# EAGLE design usb-audio (EAGLE 8.7.0)
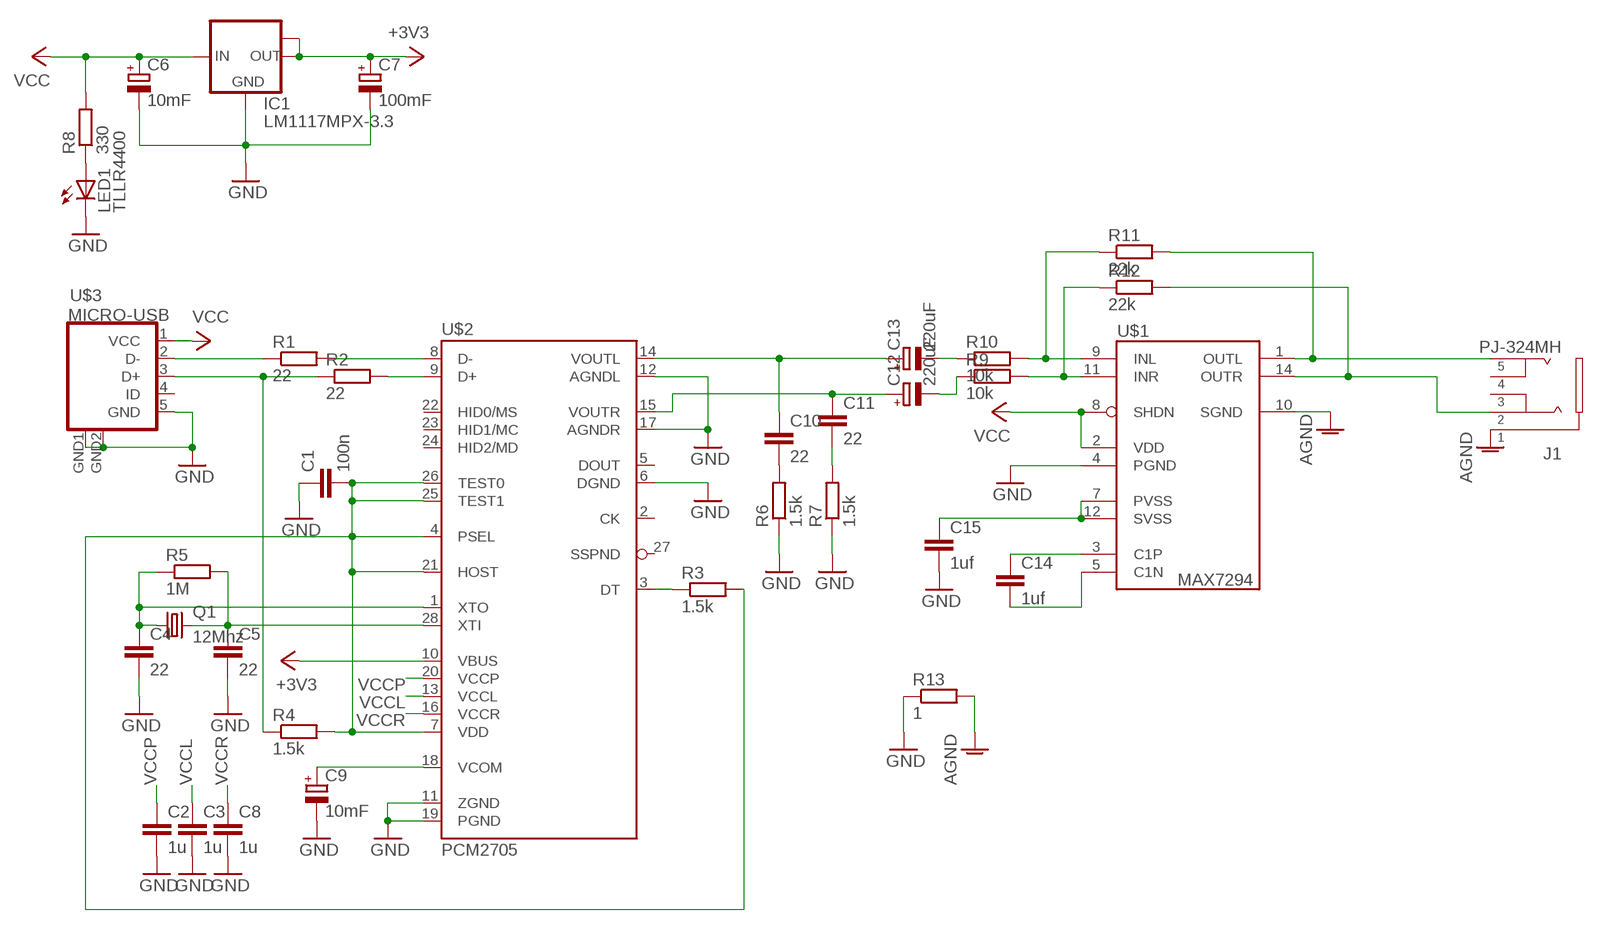
[diagram p0: schematic, sheet 1]

## Parts
C1  100n  C-EUC0805  [C0805]
C2  1u  C-EUC0805  [C0805]
C3  1u  C-EUC0805  [C0805]
C4  22  C-EUC0805  [C0805]
C5  22  C-EUC0805  [C0805]
C6  10mF  CPOL-EUCT3216  [CT3216]
C7  100mF  CPOL-EUCT3216  [CT3216]
C8  1u  C-EUC0805  [C0805]
C9  10mF  CPOL-EUCT3216  [CT3216]
C10  22  C-EUC0805  [C0805]
C11  22  C-EUC0805  [C0805]
C12  220uF  CPOL-EUE2-5  [E2-5]
C13  220uF  CPOL-EUE2-5  [E2-5]
C14  1uf  C-EUC0805  [C0805]
C15  1uf  C-EUC0805  [C0805]
IC1  LM1117MPX-3.3  [SOT223]
J1  PJ-324MH  [PJ-324MH]
LED1  TLLR4400  [LED3MM]
Q1  12Mhz  CRYSTALHC49S  [HC49/S]
R1  22  R-EU_R0805  [R0805]
R2  22  R-EU_R0805  [R0805]
R3  1.5k  R-EU_R0805  [R0805]
R4  1.5k  R-EU_R0805  [R0805]
R5  1M  R-EU_R0805  [R0805]
R6  1.5k  R-EU_R0805  [R0805]
R7  1.5k  R-EU_R0805  [R0805]
R8  330  R-EU_R0805  [R0805]
R9  10k  R-EU_R0805  [R0805]
R10  10k  R-EU_R0805  [R0805]
R11  22k  R-EU_R0805  [R0805]
R12  22k  R-EU_R0805  [R0805]
R13  1  R-EU_R0805  [R0805]
U$1  MAX9724AEUD+  [TSSOP14]
U$2  PCM2705  [SSOP28]
U$3  MICRO-USB  [MICRO-USB]

## Nets
+3V3 [VCC]: C7.+ IC1.2(OUT) IC1.TAB(OUT1) U$2.10(VBUS)
AGND [AGND]: J1.1 R13.2 U$1.10(SGND)
GND [GND]: C1.1 C2.2 C3.2 C4.2 C5.2 C6.- C7.- C8.2 C9.- C15.2 IC1.1(GND) LED1.K(C) R6.1 R7.1 R13.1 U$1.4(PGND) U$2.6(DGND) U$2.11(ZGND) U$2.12(AGNDL) U$2.17(AGNDR) U$2.19(PGND) U$3.5(GND) U$3.GND1(GND) U$3.GND2(GND)
N$1: R1.2 U$2.8(D-)
N$2: R2.2 U$2.9(D+)
N$3: C9.+ U$2.18(VCOM)
N$4: R3.1 U$2.3(DT)
N$5: R1.1 U$3.2(D-)
N$6: R2.1 R4.1 U$3.3(D+)
N$7: C5.1 Q1.2 R5.2 U$2.28(XTI)
N$8: C4.1 Q1.1 R5.1 U$2.1(XTO)
N$9 [GND]: C14.1 U$1.3(C1P)
N$10 [GND]: C14.2 U$1.5(C1N)
N$11: J1.5 R11.2 U$1.1(OUTL)
N$12: J1.2 R12.2 U$1.14(OUTR)
N$13 [GND]: C15.1 U$1.7(PVSS) U$1.12(SVSS)
N$14: C1.2 R3.2 R4.2 U$2.4(PSEL) U$2.7(VDD) U$2.21(HOST) U$2.25(TEST1) U$2.26(TEST0)
N$15: C10.2 R6.2
N$16: C11.2 R7.2
N$17: C11.1 C12.+ U$2.15(VOUTR)
N$18: C12.- R9.1
N$19: C13.- R10.1
N$20: C10.1 C13.+ U$2.14(VOUTL)
N$21: LED1.A R8.1
N$22: R10.2 R11.1 U$1.9(INL)
N$23: R9.2 R12.1 U$1.11(INR)
VCC [VCC]: C6.+ IC1.3(IN) R8.2 U$1.2(VDD) U$1.8(SHDN) U$3.1(VCC)
VCCL: C3.1 U$2.13(VCCL)
VCCP: C2.1 U$2.20(VCCP)
VCCR: C8.1 U$2.16(VCCR)
Unconnected: J1.3 J1.4 U$2.2(CK) U$2.5(DOUT) U$2.22(HID0/MS) U$2.23(HID1/MC) U$2.24(HID2/MD) U$2.27(SSPND) U$3.4(ID)

## Library data of the parts
C1-C5 C8 C10 C11 C14 C15 = rcl:C-EU: CAPACITOR, European symbol; SPICEPREFIX: C
C6 C7 C9 C12 C13 = rcl:CPOL-EU: POLARIZED CAPACITOR, European symbol; SPICEPREFIX: C
IC1 = lm1117:LM1117MPX-*
J1 = audio:PJ-324M
LED1 = led:TLLR4400: Low Current (2mA) LED 3 mm Tinted Diffused Package color RED Source: Data sheet <http://www.farnell.com/datasheets/391100.pdf>; MF: VISHAY SEMICONDUCTOR; OC_FARNELL: 1612437
Q1 = crystal:CRYSTAL: CRYSTAL; OC_FARNELL: 1667008; OC_NEWARK: unknown
R1-R13 = rcl:R-EU_: RESISTOR, European symbol
U$1 = max9724:MAX9724AEUD+: MAX9724 Stereo Headphone Amplifier
U$2 = PCM2705:PCM2705: PCM2705 USB Audio DAC
U$3 = microusb:MICRO-USB: Micro USB B connector

## Net classes
0 default: width 0.3 mm
1 VCC: width 0.5 mm
2 GND: width 0.5 mm
3 AGND: width 0.5 mm

## Board
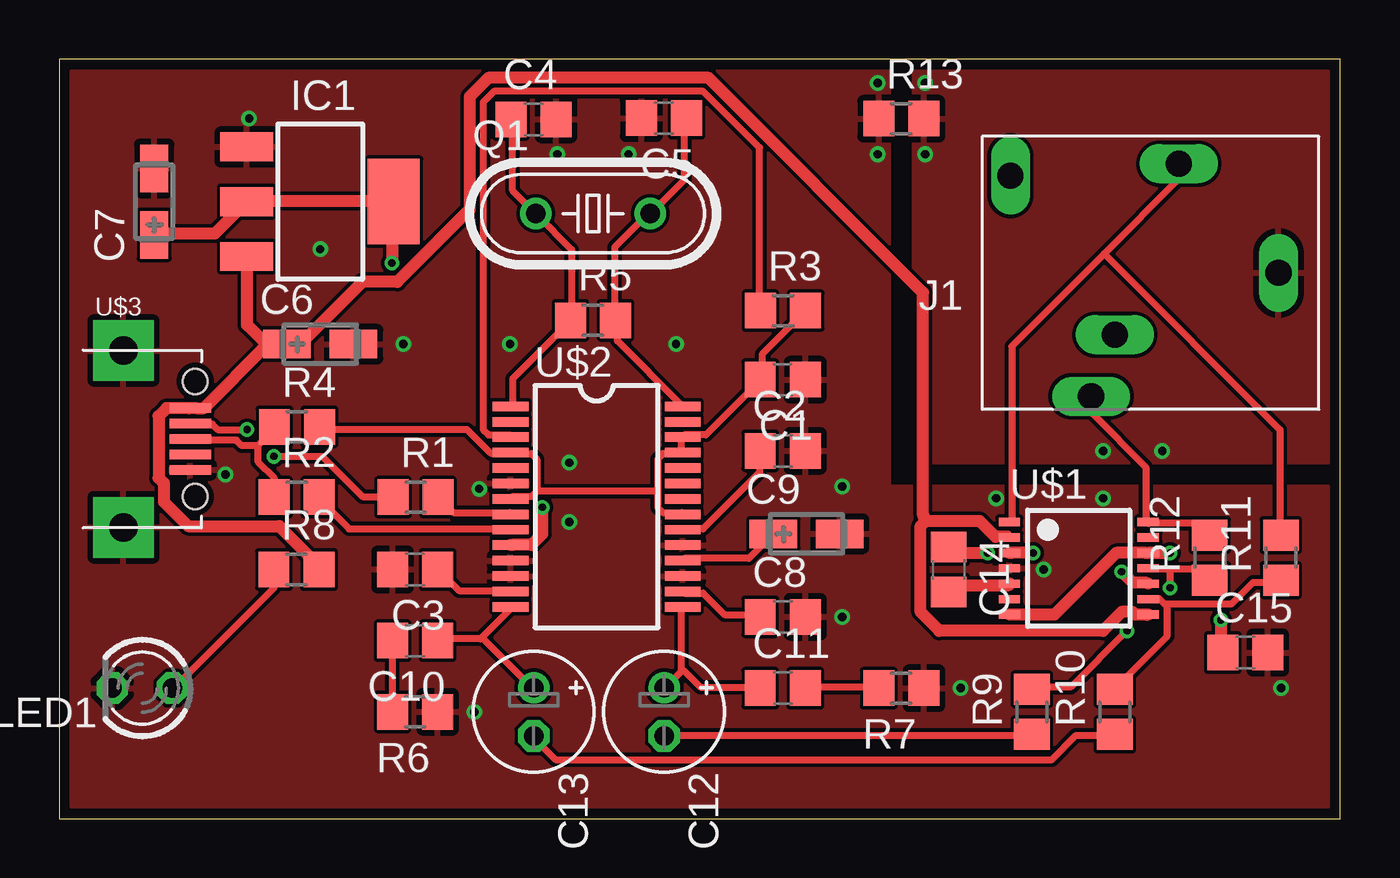
[diagram p1: board, top side]
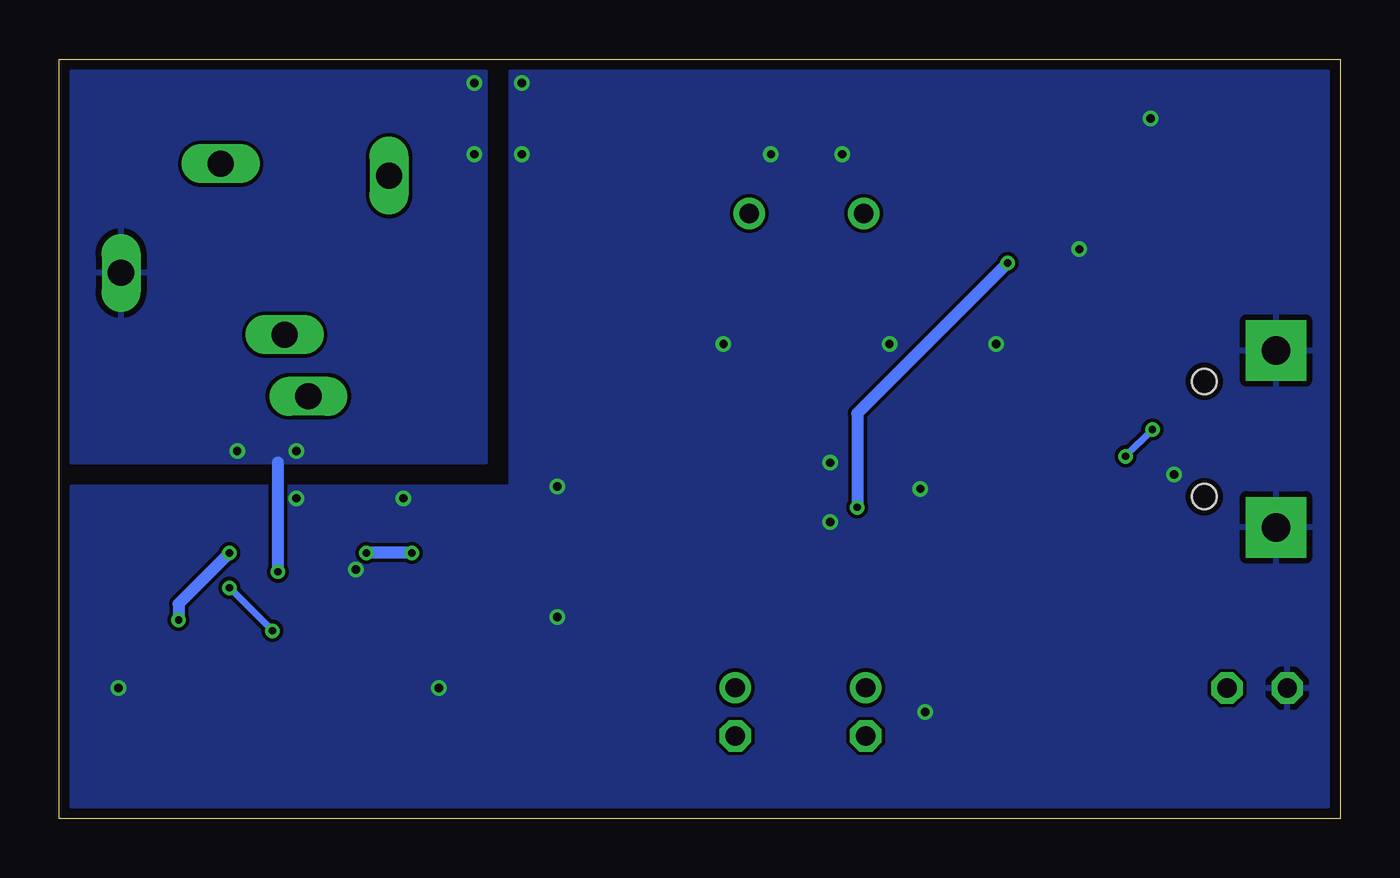
[diagram p2: board, bottom side, seen from below]

Size 54 x 32 mm. Coordinates in mm from the lower left corner, seen from the top.
Outline: 0,0 54,0 54,32 0,32 0,0
Copper layers (1*16): Top 0.035mm / dielectric 1.5mm / Bottom 0.035mm
Design rules "SeeedStudio_2layer_DRU_no_angle_20140221": minimum track width 6mil, minimum drill 12mil, track to track 6mil, track to pad 6mil, pad to pad 6mil, via to via 6mil, smd to smd 0mil, copper to edge 10mil, drill to drill 10mil, minimum pad ring 10mil, minimum via ring 6mil, stop-mask expansion 2mil, vias tented up to drill 100mil, thermal gap 10mil

### Footprints (pad centres in the part's own frame; a part is rotated, then mirrored left to right if it is on the bottom)
C0805 = smd 1.3 x 1.5: 1 -0.95,0; 2 0.95,0
CT3216 = smd 2 x 1.2: + -1.4,0; - 1.4,0
E2-5 = drill 0.813 pad 1.27: + -1.016,0 | drill 0.813 pad 1.27 octagon: - 1.016,0
SOT223 = smd 1.219 x 2.235: 1 -2.311,-3.099; 2 0,-3.099; 3 2.311,-3.099 | smd 3.6 x 2.2: TAB 0,3.099
PJ-324MH = drill 1.1 long: 1 -5.4,0; 2 2.5,5.2; 3 1.5,2.6; 4 5.9,-4.1; 5 -1.2,-4.6
LED3MM = drill 0.813 octagon: A -1.27,0; K 1.27,0
HC49/S = drill 0.813: 1 -2.413,0; 2 2.413,0
R0805 = smd 1.3 x 1.5: 1 -0.95,0; 2 0.95,0
TSSOP14 = smd 0.35 x 0.9: 1 -1.95,-2.925; 2 -1.3,-2.925; 3 -0.65,-2.925; 4 0,-2.925; 5 0.65,-2.925; 6 1.3,-2.925; 7 1.95,-2.925; 8 1.95,2.925; 9 1.3,2.925; 10 0.65,2.925; 11 0,2.925; 12 -0.65,2.925; 13 -1.3,2.925; 14 -1.95,2.925
SSOP28 = smd 0.4 x 1.5: 1 -4.225,-3.625; 2 -3.575,-3.625; 3 -2.925,-3.625; 4 -2.275,-3.625; 5 -1.625,-3.625; 6 -0.975,-3.625; 7 -0.325,-3.625; 8 0.325,-3.625; 9 0.975,-3.625; 10 1.625,-3.625; 11 2.275,-3.625; 12 2.925,-3.625; 13 3.575,-3.625; 14 4.225,-3.625; 15 4.225,3.625; 16 3.575,3.625; 17 2.925,3.625; 18 2.275,3.625; 19 1.625,3.625; 20 0.975,3.625; 21 0.325,3.625; 22 -0.325,3.625; 23 -0.975,3.625; 24 -1.625,3.625; 25 -2.275,3.625; 26 -2.925,3.625; 27 -3.575,3.625; 28 -4.225,3.625
MICRO-USB = smd 0.4 x 1.75: 1 -1.3,4.525; 2 -0.65,4.525; 3 0,4.525; 4 0.65,4.525; 5 1.3,4.525 | drill 1.2 pad 2.54 square: GND1 -3.725,1.7; GND2 3.725,1.7 | hole 1.05: -2.425,4.73; 2.425,4.73

### Placement (x,y rotation side)
C1  30.5,18.5 180 top
C2  30.5,15.5 0 top
C3  15,10.5 180 top
C4  19.99,29.47 0 top
C5  25.49,29.52 180 top
C6  11,20 0 top
C7  4,26 90 top
C8  30.5,8.5 0 top
C9  31.5,12 0 top
C10  15,7.5 180 top
C11  30.5,5.5 0 top
C12  25.5,4.5 270 top
C13  20,4.5 270 top
C14  37.5,10.5 270 top
C15  50,7 0 top
IC1  11,26 270 top
J1  46,23 180 top
LED1  3.5,5.5 180 top
Q1  22.5,25.5 0 top
R1  15.02,13.55 0 top
R2  10.01,13.55 0 top
R3  30.51,21.41 0 top
R4  10.02,16.51 0 top
R5  22.5,21 0 top
R6  15,4.5 180 top
R7  35.5,5.5 180 top
R8  10,10.5 0 top
R9  41,4.5 90 top
R10  44.5,4.5 90 top
R11  51.5,11 90 top
R12  48.5,11 90 top
R13  35.5,29.5 0 top
U$1  42.98,10.55 270 top
U$2  22.65,13.15 270 top
U$3  1,16 270 top

### Tracks (layer width: path | path; a pad name or v marks a point on that pad's centre or on a via)
+3V3  (via drill 0.3)
  Top 0.5: C7.+ 4.07,24.66 6.56,24.66 7.8,25.9 IC1.2 8.14,26.01 13.8,26.01 IC1.TAB 14.02,25.9 v14.02,23.41 | v20.36,13.12 20.36,11.99 19.91,11.54 19.11,11.54 U$2.10
  Bottom 0.5: v20.36,13.12 20.36,17.08 v14.02,23.41
AGND  (via drill 0.3, 0.35)
  Top 0.5: v44.79,10.4 45.24,9.95 45.81,9.95 U$1.10
  Bottom 0.5: 44.79,15 v44.79,10.4
  other vias: 44,15.5 46.5,15.5 36.5,31 36.5,28
  pour Bottom: 36,31.5 53.5,31.5 53.5,15 36,15
  pour Top: 36,31.5 36,15 53.5,15 53.5,31.5
GND  (via drill 0.35)
  other vias: 11,24 14.5,20 39.5,13.5 44,13.5 34.5,31 34.5,28 21,28 24,28 21.5,15 21.5,12.5 19,20 26,20 17.7,13.9 7,14.5 33,14 33,8.5 38,5.5 51.5,5.5 41.5,10.5 17.5,4.5 8,29.5
  pour Top: 0.5,31.5 35,31.5 35,14 53.5,14 53.5,0.5 0.5,0.5
  pour Bottom: 0.5,31.5 35,31.5 35,14 53.5,14 53.5,0.5 0.5,0.5
N$1
  Top 0.3: U$2.8 19,12.89 16.63,12.89 16.06,13.46 R1.2
N$2
  Top 0.3: U$2.9 19,12.21 12.21,12.21 10.97,13.46 R2.2
N$3
  Top 0.3: U$2.18 26.35,10.97 29.07,10.97 30.09,11.99 C9.+
N$4
  Top 0.3: U$2.3 19,16.17 18.1,16.17 17.87,16.4 17.87,30.2 18.32,30.65 27.14,30.65 29.52,28.27 29.52,21.49 R3.1
N$5  (via drill 0.3)
  Top 0.3: v9.05,15.27 11.08,15.27 12.78,13.57 14.02,13.57 R1.1 | v7.92,16.4 6.67,16.4 6.45,16.63 5.54,16.63 U$3.2
  Bottom 0.3: v7.92,16.4 v9.05,15.27
N$6
  Top 0.3: 8.37,15.72 8.37,15.04 9.05,14.36 9.05,13.57 R2.1 | 8.37,15.72 9.05,16.4 R4.1 | 8.37,15.72 7.69,15.72 7.46,15.95 5.54,15.95 U$3.3
N$7
  Top 0.3: U$2.28 26.24,17.42 23.52,20.13 23.52,20.92 R5.2 23.41,21.15 23.41,24.09 24.77,25.45 Q1.2 25,25.56 26.35,26.92 26.35,29.52 C5.1
N$8
  Top 0.3: U$2.1 19.11,17.42 19.11,18.55 21.49,20.92 R5.1 21.6,21.15 21.6,23.98 20.13,25.45 Q1.1 20.02,25.56 19.11,26.46 19.11,29.41 C4.1
N$9  (via drill 0.3)
  Top 0.5: v41.05,11.2 40.15,11.2 U$1.3 | v39.13,11.2 37.77,11.2 37.55,11.42 C14.1
  Bottom 0.5: v39.13,11.2 v41.05,11.2
N$10
  Top 0.5: U$1.5 40.04,9.84 37.77,9.84 37.55,9.61 C14.2
N$11
  Top 0.3: 44.05,23.81 47.16,26.92 47.16,27.6 J1.5 | 44.05,23.81 40.15,19.91 40.15,12.55 U$1.1 | 44.05,23.81 51.46,16.4 51.46,11.99 R11.2
N$12
  Top 0.3: R12.2 48.41,11.99 47.95,12.44 45.92,12.44 U$1.14 45.81,12.55 45.81,14.82 43.54,17.08 43.54,17.76 J1.2
N$13  (via drill 0.3)
  Top 0.5: U$1.7 40.15,8.6 41.96,8.6 44.56,11.2 45.81,11.2 U$1.12 46.15,11.2 v46.82,11.2 | v48.97,8.37 48.97,7.01 C15.1
  Bottom 0.5: v48.97,8.37 48.97,9.05 v46.82,11.2
N$14
  Top 0.3: 20.13,13.8 19.91,13.57 19.11,13.57 U$2.7 | 20.13,13.8 20.13,15.15 19.91,15.38 19.11,15.38 U$2.4 18.89,15.38 18.21,15.38 17.19,16.4 10.97,16.4 R4.2 | 25.22,13.8 25.22,15.15 25.45,15.38 26.24,15.38 U$2.25 26.24,15.49 26.24,16.06 U$2.26 26.35,16.17 27.26,16.17 29.52,18.43 C1.2 29.63,18.55 29.63,19.57 31.44,21.38 R3.2 | 25.22,13.8 25.22,13.12 25.45,12.89 26.24,12.89 U$2.21 | 25.22,13.8 20.13,13.8
N$15
  Top 0.3: R6.2 14.02,4.52 14.02,7.46 C10.2
N$16
  Top 0.3: C11.2 31.55,5.54 34.49,5.54 R7.2
N$17
  Top 0.3: 26.24,6.22 26.24,8.82 U$2.15 | 26.24,6.22 25.56,5.54 C12.+ | C11.1 29.52,5.54 27.03,5.54 26.35,6.22 26.24,6.22
N$18
  Top 0.3: R9.1 40.94,3.51 25.56,3.51 C12.-
N$19
  Top 0.3: R10.1 44.45,3.51 42.87,3.51 41.85,2.49 20.92,2.49 20.02,3.39 C13.-
N$20
  Top 0.3: 17.76,7.58 16.06,7.58 C10.1 | 17.76,7.58 19,8.82 U$2.14 | C13.+ 19.91,5.54 17.87,7.58 17.76,7.58
N$21
  Top 0.3: R8.1 9.05,10.4 9.05,9.73 4.86,5.54 LED1.A
N$22
  Top 0.3: 46.65,8.99 46.71,8.94 46.71,7.69 44.56,5.54 R10.2 | 46.65,8.99 46.37,9.27 45.92,9.27 U$1.9 | R11.1 51.46,9.95 50.33,9.95 49.42,9.05 46.71,9.05 46.65,8.99
N$23  (via drill 0.3)
  Top 0.3: 46.82,10.52 47.95,10.52 48.41,10.07 R12.1 | 46.82,10.52 45.92,10.52 U$1.11 | v45.01,7.92 42.64,5.54 41.05,5.54 R9.2 | 46.82,10.52 v46.82,9.73
  Bottom 0.3: v46.82,9.73 v45.01,7.92
VCC
  Top 0.3: U$1.2 40,12 39.5,12 39.42,11.92
  Top 0.5: R8.2 10.86,10.52 10.86,10.74 9.27,12.33 5.43,12.33 4.41,13.35 4.41,14.14 4.18,14.36 4.18,16.96 4.52,17.3 5.43,17.3 U$3.1 5.77,17.3 6.11,17.3 8.71,19.91 | 8.71,19.91 9.27,19.91 C6.+ 9.84,20.02 10.18,20.02 12.78,22.62 14.25,22.62 17.3,25.67 17.3,30.42 18.1,31.22 27.37,31.22 36.42,22.17 36.42,12.78 36.53,12.55 | IC1.3 7.92,23.64 7.92,20.81 8.6,20.13 8.71,19.91 | 39.47,11.88 39.42,11.92 38.79,12.55 36.53,12.55 | 36.53,12.55 36.3,12.33 36.3,8.71 37.1,7.92 44,7.92 44.79,8.71 45.24,8.71 45.35,8.6 45.81,8.6 U$1.8
VCCL
  Top 0.3: U$2.13 19,9.61 16.85,9.61 16.06,10.4 C3.1
VCCP
  Top 0.3: U$2.20 26.35,12.21 27.14,12.21 29.52,14.59 29.52,15.49 C2.1
VCCR
  Top 0.3: C8.1 29.52,8.6 28.05,8.6 27.14,9.5 26.35,9.5 U$2.16